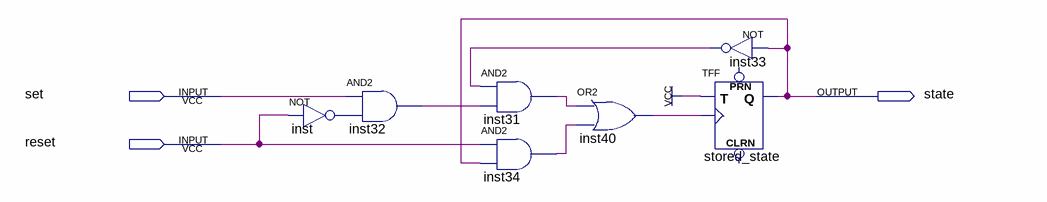
[diagram p0: schematic sheet]
// Quartus schematic state_trigger.bdf as structural Verilog: 7 symbols, 3 pins
module state_trigger (
  input  set,
  input  reset,
  output state
);

  wire inst31_out, inst32_out, inst33_out, inst34_out, inst40_out, inst_out;

  and inst32 (inst32_out, set, inst_out);
  not inst (inst_out, reset);
  and inst31 (inst31_out, inst33_out, inst32_out);
  and inst34 (inst34_out, reset, state);
  or inst40 (inst40_out, inst31_out, inst34_out);
  not inst33 (inst33_out, state);
  TFF stored_state (.T(1'b1), .CLK(inst40_out), .Q(state));  // open: PRN, CLRN
endmodule
